# Altium project HYDRA_V3_BEACON.PrjPcb (part 2 of 2)

## Sheet SX1278_RADIO.SchDoc
size B; SheetNumber: 6; SheetTotal: 7
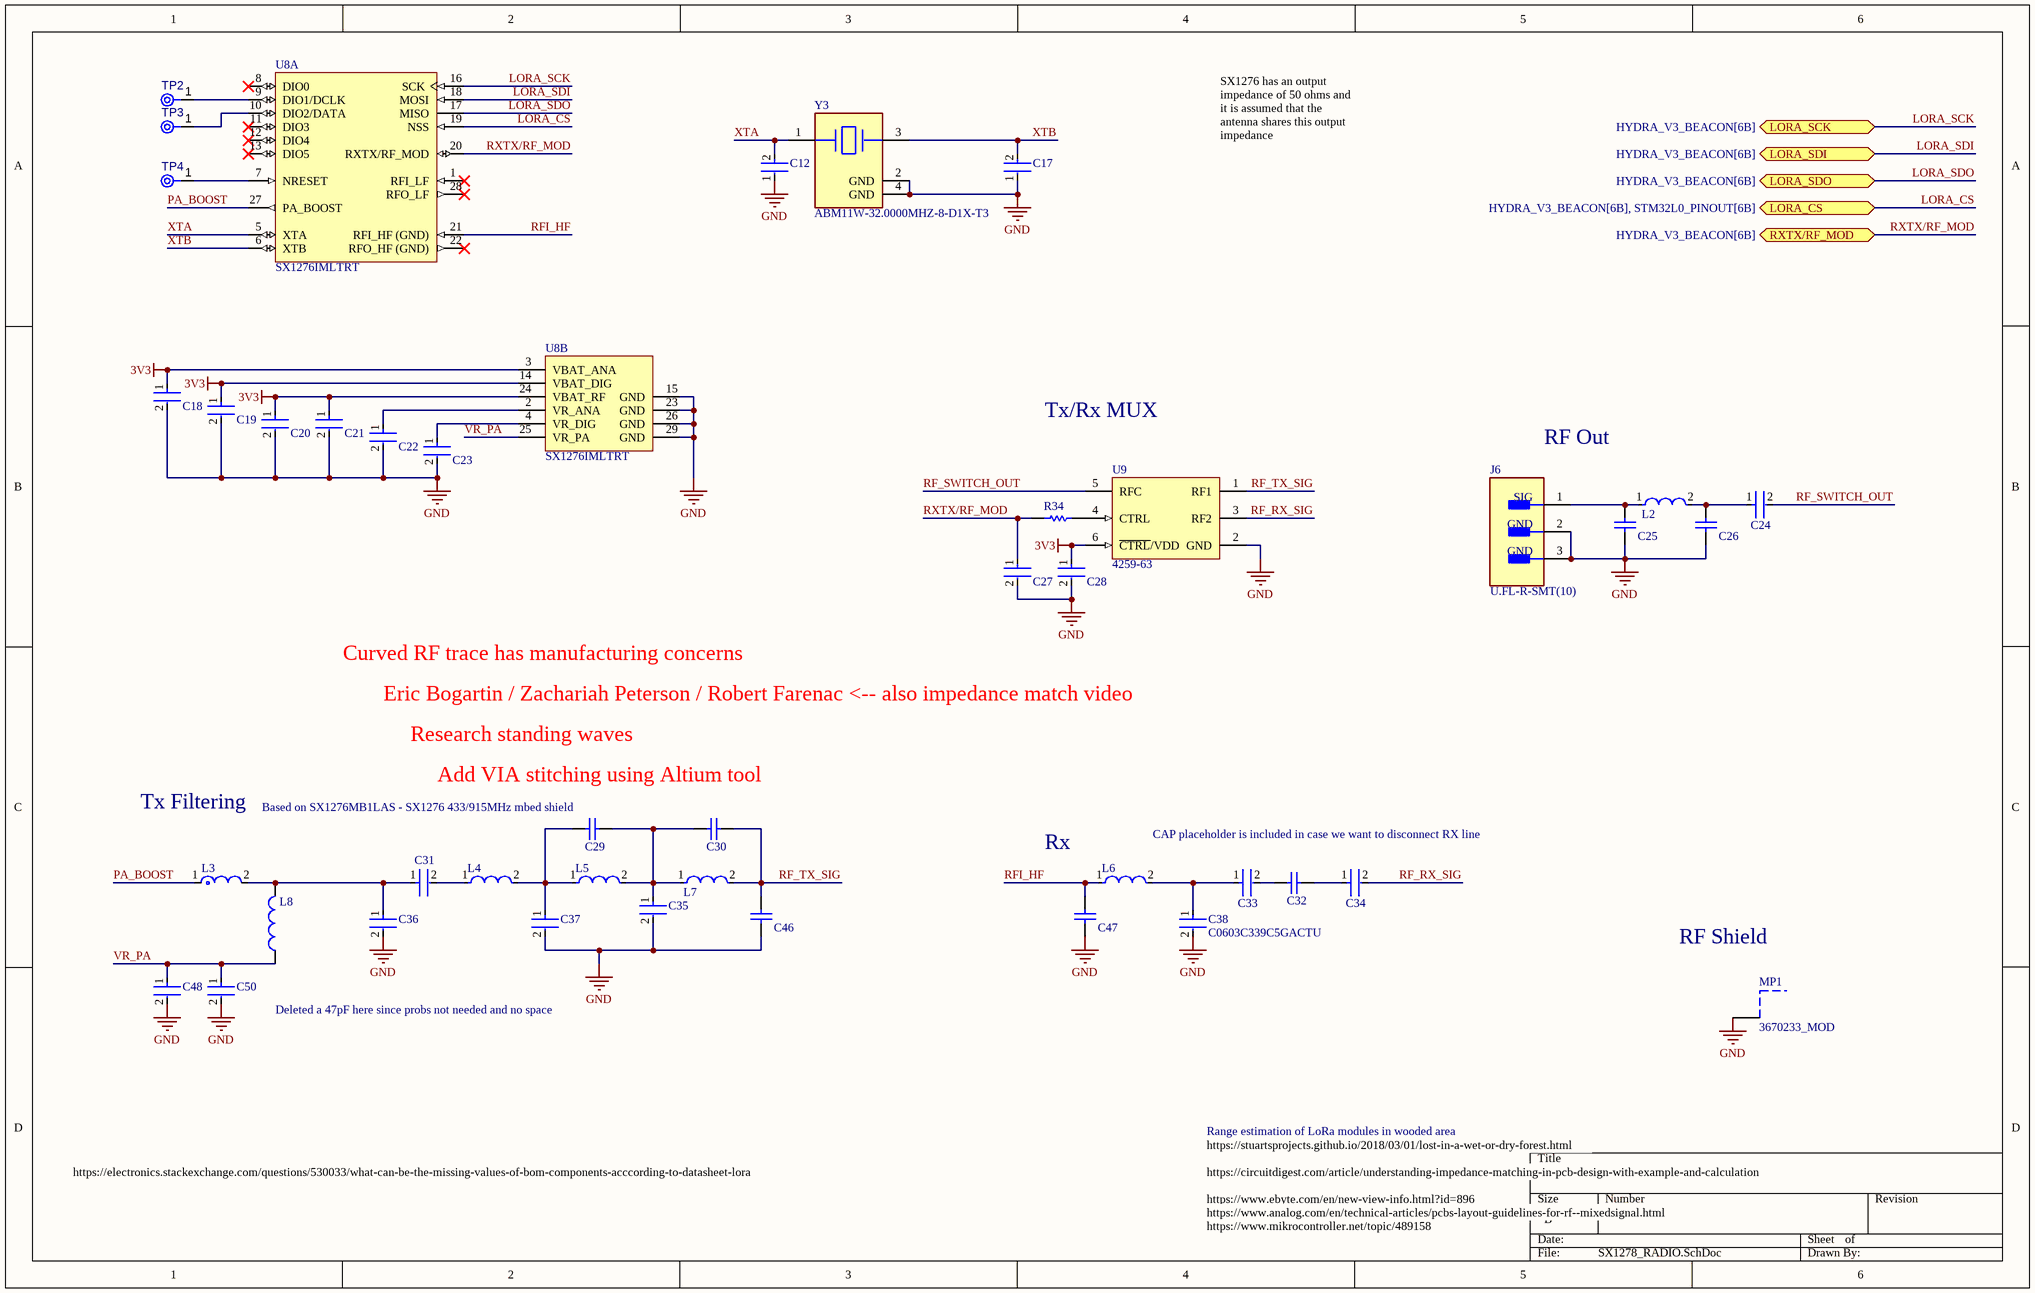
[diagram p5: SX1278_RADIO.SchDoc]

### Parts
C12  C1608C0G1H080D080AA  [FP-C1608-080-0_1-IPC_A]  (value not drawn)
C17  C1608C0G1H080D080AA  [FP-C1608-080-0_1-IPC_A]  (value not drawn)
C18  C0402C104K8PACTU  [FP-C0402-BB-MFG]  (value not drawn)
C19  C0402C104K8PACTU  [FP-C0402-BB-MFG]  (value not drawn)
C20  C0402C104K8PACTU  [FP-C0402-BB-MFG]  (value not drawn)
C21  C0402C104K8PACTU  [FP-C0402-BB-MFG]  (value not drawn)
C22  C0402C104K8PACTU  [FP-C0402-BB-MFG]  (value not drawn)
C23  C0402C104K8PACTU  [FP-C0402-BB-MFG]  (value not drawn)
C24  C0603C470J1GACTU  [FP-C0603C-CF-MFG]  (value not drawn)
C25  0603 CAP  [CAPC1608X90X40ML10T20]  (value not drawn)
C26  0603 CAP  [CAPC1608X90X40ML10T20]  (value not drawn)
C27  C0402C104K8PACTU  [FP-C0402-BB-MFG]  (value not drawn)
C28  C0402C104K8PACTU  [FP-C0402-BB-MFG]  (value not drawn)
C29  0603 CAP  [CAPC1608X90X40ML10T20]  (value not drawn)
C30  0603 CAP  [CAPC1608X90X40ML10T20]  (value not drawn)
C31  C0603C220J5GACTU  [FP-C0603C-CF-MFG]  (value not drawn)
C32  0603 CAP  [CAPC1608X90X40ML10T20]  (value not drawn)
C33  C0603C470J1GACTU  [FP-C0603C-CF-MFG]  (value not drawn)
C34  C0603C470J1GACTU  [FP-C0603C-CF-MFG]  (value not drawn)
C35  C0603C339C5GACTU  [FP-C0603C-CF-MFG]  (value not drawn)
C36  C0603C829C5GACTU  [FP-C0603C-CF-MFG]  (value not drawn)
C37  06031A6R8CAT2A  [FP-0603-L_1_6_0_15-W_0_81-IPC_C]  (value not drawn)
C38  C0603C339C5GACTU  [FP-C0603C-CF-MFG]
C46  0603 CAP  [CAPC1608X90X40ML10T20]  (value not drawn)
C47  0603 CAP  [CAPC1608X90X40ML10T20]  (value not drawn)
C48  C0603C103J3GACTU  [FP-C0603C-CF-MFG]  (value not drawn)
C50  C0603C470J1GACTU  [FP-C0603C-CF-MFG]  (value not drawn)
J6  U.FL-R-SMT(10)  [FP-U_FL-R-SMT_10-MFG]
L2  0603 IND  [FP-LQW18AN_00-MFG]  (value not drawn)
L3  LQG18HN1N5S00D  [FP-LQG18HH_00-IPC_B]  (value not drawn)
L4  LQW18AN5N6D00D  [FP-LQW18AN_00-MFG]  (value not drawn)
L5  LQW18AN5N6D00D  [FP-LQW18AN_00-MFG]  (value not drawn)
L6  LQW18AN10NG00D  [FP-LQW18AN_00-MFG]  (value not drawn)
L7  0603 IND  [FP-LQW18AN_00-MFG]  (value not drawn)
L8  B82496C3330J  [INDC1608X90X30LL10T20]  (value not drawn)
MP1  3670233_MOD  [3670233]
R34  ERJ-3EKF1001V  [RESC1608X55X30LL15T15]  (value not drawn)
TP2  TPAD6R  [TP06R]  (value not drawn)  (no BOM)
TP3  TPAD6R  [TP06R]  (value not drawn)  (no BOM)
TP4  TPAD6R  [TP06R]  (value not drawn)  (no BOM)
U8  SX1276IMLTRT  [SMTC-QFN-28_V]  (parts A,B of 2)
U9  4259-63  [PERE-SC-70-6_M]
Y3  ABM11W-32.0000MHZ-8-D1X-T3  [FP-ABM11W-MFG]

### Ports
LORA_CS (bidir, see HYDRA_V3_BEACON[6B], STM32L0_PINOUT[6B]), LORA_SCK (bidir, see HYDRA_V3_BEACON[6B]), LORA_SDI (bidir, see HYDRA_V3_BEACON[6B]), LORA_SDO (bidir, see HYDRA_V3_BEACON[6B]), RXTX/RF_MOD (bidir, see HYDRA_V3_BEACON[6B])

### Nets
3V3: C18.1 C19.1 C20.1 C21.1 C28.1 U8.3(VBAT_ANA) U8.14(VBAT_DIG) U8.24(VBAT_RF) U9.6(~{CTRL}/VDD)
GND: C12.1 C17.1 C18.2 C19.2 C20.2 C21.2 C22.2 C23.2 C25.1 C26.1 C27.2 C28.2 C35.2 C36.2 C37.2 C38.2 C46.1 C47.1 C48.2 C50.2 J6.2(GND) J6.3(GND) MP1.1 U8.15(GND) U8.23(GND) U8.26(GND) U8.29(GND) U9.2(GND) Y3.2(GND) Y3.4(GND)
LORA_CS: U8.19(NSS) ; port LORA_CS
LORA_SCK: U8.16(SCK) ; port LORA_SCK  [project net CAN_SCK]
LORA_SDI: U8.18(MOSI) ; port LORA_SDI  [project net CAN_SDI]
LORA_SDO: U8.17(MISO) ; port LORA_SDO  [project net CAN_SDO]
PA_BOOST: L3.1 U8.27(PA_BOOST)
RF_RX_SIG: C34.2 U9.3(RF2)
RF_SWITCH_OUT: C24.2 U9.5(RFC)
RF_TX_SIG: C30.2 C46.2 L7.2 U9.1(RF1)
RFI_HF: C47.2 L6.1 U8.21(RFI_HF_(GND))
RXTX/RF_MOD: C27.1 R34.2 U8.20(RXTX/RF_MOD) ; port RXTX/RF_MOD
VR_PA: C48.1 C50.1 L8.1 U8.25(VR_PA)
XTA: C12.2 U8.5(XTA) Y3.1
XTB: C17.2 U8.6(XTB) Y3.3
NetC22_1: C22.1 U8.2(VR_ANA)
NetC23_1: C23.1 U8.4(VR_DIG)
NetC24_1: C24.1 C26.2 L2.2
NetC25_2: C25.2 J6.1(SIG) L2.1
NetC29_1: C29.1 C37.1 L4.2 L5.1
NetC29_2: C29.2 C30.1 C35.1 L5.2 L7.1
NetC31_1: C31.1 C36.1 L3.2 L8.2
NetC31_2: C31.2 L4.1
NetC32_1: C32.1 C33.2
NetC32_2: C32.2 C34.1
NetC33_1: C33.1 C38.1 L6.2
NetR34_1: R34.1 U9.4(CTRL)
NetTP2_1: TP2.1(TP) U8.9(DIO1/DCLK)
NetTP3_1: TP3.1(TP) U8.10(DIO2/DATA)
NetTP4_1: TP4.1(TP) U8.7(NRESET)

Not connected (* = marked no-connect by the designer): U8 1(RFI_LF)* 8(DIO0)* 11(DIO3)* 12(DIO4)* 13(DIO5)* 22(RFO_HF_(GND))* 28(RFO_LF)*

### Notes on the sheet
- SX1276 has an output impedance of 50 ohms and it is assumed that the antenna shares this output impedance
- Tx/Rx MUX
- RF Out
- Curved RF trace has manufacturing concerns
- Eric Bogartin / Zachariah Peterson / Robert Farenac <-- also impedance match video
- Research standing waves
- Tx Filtering
- (near C29) Based on SX1276MB1LAS - SX1276 433/915MHz mbed shield
- Add VIA stitching using Altium tool
- CAP placeholder is included in case we want to disconnect RX line
- Rx
- RF Shield
- Deleted a 47pF here since probs not needed and no space
- https://electronics.stackexchange.com/questions/530033/what-can-be-the-missing-values-of-bom-components-acccording-to-datasheet-lora
- https://stuartsprojects.github.io/2018/03/01/lost-in-a-wet-or-dry-forest.html
- https://circuitdigest.com/article/understanding-impedance-matching-in-pcb-design-with-example-and-calculation
- Range estimation of LoRa modules in wooded area
- https://www.ebyte.com/en/new-view-info.html?id=896
- https://www.mikrocontroller.net/topic/489158
- https://www.analog.com/en/technical-articles/pcbs-layout-guidelines-for-rf--mixedsignal.html

### Library data of the parts
C12 C17 = CMP-08246-005081-1: Multilayer Ceramic Capacitors 8pF ±0.5pF 50V C0G SMD 0603; Insulation Resistance: 10GR; Case Code (Metric): 1608; Series: C; Construction: Flat; REACH SVHC: No SVHC; Weight: 7.1E-05oz; Length: 1.6mm; RoHS Compliant: Yes; Min Operating Temperature: -55°C; Dielectric Material: Ceramic; Dielectric: C0G; Case/Package: 0603; Width: 0.031inch; Lead Free: Lead Free; Voltage Rating (DC): 50V; Thickness: 0.037inch; Capacitance: 8pF; Radiation Hardening: No; Height: 0.8mm; Voltage Rating: 50V; Depth: 0.8mm; Package Quantity: 1; Termination: SMD/SMT; Mount: Surface Mount; Packaging: Tape and Reel; Case Code (Imperial): 0603; Max Operating Temperature: 125°C
C18-C23 C27 C28 = CMP-2008-02046-2: CAP CER 0.1UF 10V X5R 0402; Manufacturer: Kemet; Material: Ceramic; Capacitance: 0.10 μF; Temperature Coefficient: 15%; Tolerance: 0.1; Value: 0.10 μF; Package: C0402-BB; Temperature: -55°C to +125°C; ComponentLink2Description: Datasheet; Temperature Characteristic: X5R; Device Class L1: Passive Components; Height: 0.55mm; Lead Free: Yes; ComponentLink2URL: https://content.kemet.com/datasheets/KEM_C1002_X7R_SMD.pdf; Device Class L2: Capacitors; Temperature Range Low: -55°C; Temperature Range High: +125°C; RoHS: TRUE; Octopart: https://octopart.com/c0402c104k8pactu-kemet-140039; Automotive: No; Mouser Description: Capacitor 100 nF 10 VDC 0402; Category: Cap; Voltage Rating: 10 V; Digikey Description: CAP CER 0.1UF 10V X5R 0402; Ipc Land Pattern Name: CAPC10050X50; Device Class L3: Ceramic Capacitors; Manufacturer Part Number: C0402C104K8PACTU
C24 C33 C34 C50 = CMP-2006-03321-2: CAP CER 47PF 100V 5% NP0 0603; Manufacturer: KEMET; Temperature Characteristic: C0G; Temperature Coefficient: 30ppm/°C; Automotive Grade: Grade 1; Material: Ceramic; Tolerance: 0.05; Digikey Description: CAP CER 47PF 100V 5% NP0 0603; Value: 47 pF; Category: Cap; Device Class L2: Capacitors; Device Class L1: Passive Components; Package: C0603C-CF; Octopart: https://octopart.com/c0603c470j1gactu-kemet-3768219; Lead Free: Yes; Temperature Range High: +125°C; Device Class L3: Ceramic Capacitors; Height: 0.87mm; Temperature: -55°C to +125°C; Mouser Description: Multilayer Ceramic Capacitors MLCC - SMD/SMT 100volts 47pF C0G 5%; Automotive: Yes; Capacitance: 47 pF; RoHS: TRUE; ComponentLink2URL: https://api.kemet.com/component-edge/download/datasheet/C0603C100J5GACAUTO.pdf; Voltage Rating: 100 V; Manufacturer Part Number: C0603C470J1GACTU; ComponentLink2Description: Datasheet; Temperature Range Low: -55°C
C25 C26 C29 C30 C32 C46 C47 = CMP-001-00087-1: 0pF 0603 capacitor placeholder
C31 = CMP-2006-03119-3: Cap Ceramic 22pF 50V C0G 5% SMD 0603 125°C Paper T/R; Manufacturer: KEMET; Temperature Coefficient: 30ppm/°C; Automotive Grade: Grade 1; Tolerance: 0.05; RoHS: TRUE; Temperature Characteristic: C0G; Capacitance: 22 pF; Device Class L3: Ceramic Capacitors; Digikey Description: Cap Ceramic 22pF 50V C0G 5% SMD 0603 125°C Paper T/R; ComponentLink2URL: https://api.kemet.com/component-edge/download/datasheet/C0603C100J5GACAUTO.pdf; ComponentLink2Description: Datasheet; Automotive: Yes; Temperature: -55°C to +125°C; Temperature Range High: +125°C; Package: C0603C-CF; Device Class L1: Passive Components; Device Class L2: Capacitors; Lead Free: Yes; Value: 22 pF; Manufacturer Part Number: C0603C220J5GACTU; Category: Cap; Mouser Description: Cap Ceramic 22pF 50V C0G 5% SMD 0603 125°C Paper T/R; Voltage Rating: 50 V; Height: 0.87mm; Material: Ceramic; Temperature Range Low: -55°C; Octopart: https://octopart.com/c0603c220j5gactu-kemet-98525
C35 C38 = CMP-1035-00238-3: CAP CER 3.3PF 50V NP0 0603; Manufacturer: KEMET; Tolerance: 0.25 pF; Material: Ceramic; Temperature Characteristic: C0G; Automotive Grade: Grade 1; Temperature Coefficient: 30ppm/°C; Height: 0.87mm; Category: Cap; Automotive: Yes; Voltage Rating: 50 V; Capacitance: 3.3 pF; ComponentLink2Description: Datasheet; Octopart: https://octopart.com/c0603c339c5gactu-kemet-3701205; Temperature Range Low: -55°C; Device Class L3: Ceramic Capacitors; Manufacturer Part Number: C0603C339C5GACTU; Package: C0603C-CF; Temperature: -55°C to +125°C; Digikey Description: CAP CER 3.3PF 50V NP0 0603; Temperature Range High: +125°C; ComponentLink2URL: https://api.kemet.com/component-edge/download/datasheet/C0603C100J5GACAUTO.pdf; Device Class L1: Passive Components; Value: 3.3 pF; RoHS: TRUE; Lead Free: Yes; Mouser Description: Multilayer Ceramic Capacitors MLCC - SMD/SMT 50volts 3.3pF C0G 0.25%; Device Class L2: Capacitors
C36 = CMP-2006-03332-2: CAP CER 8.2PF 50V NP0 0603; Manufacturer: KEMET; Temperature Coefficient: 30ppm/°C; Temperature Characteristic: C0G; Material: Ceramic; Tolerance: 0.25 pF; Automotive Grade: Grade 1; Octopart: https://octopart.com/c0603c829c5gactu-kemet-8375751; Automotive: Yes; RoHS: TRUE; Manufacturer Part Number: C0603C829C5GACTU; Temperature Range High: +125°C; Category: Cap; Digikey Description: CAP CER 8.2PF 50V NP0 0603; Value: 8.2 pF; Temperature: -55°C to +125°C; Package: C0603C-CF; Device Class L1: Passive Components; Device Class L3: Ceramic Capacitors; Device Class L2: Capacitors; ComponentLink2Description: Datasheet; Height: 0.87mm; Capacitance: 8.2 pF; Lead Free: Yes; Voltage Rating: 50 V; Mouser Description: Multilayer Ceramic Capacitors MLCC - SMD/SMT 50volts 8.2pF C0G 0.25%; ComponentLink2URL: https://api.kemet.com/component-edge/download/datasheet/C0603C100J5GACAUTO.pdf; Temperature Range Low: -55°C
C37 = CMP-1035-00440-3: General Purpose Ceramic Capacitor, 0603, 6.8pF, 0.25pF, NP0, 30ppm/°C, 100V; Dielectric: C0G; Voltage Rating: 100V; Package Quantity: 1; Height: 0.86mm; Number of Pins: 2; Depth: 0.81mm; Voltage: 100V; Case Code (Imperial): 0603; Series: -; Case/Package: 0603; Capacitance: 6.8pF; Termination: SMD/SMT; Case Code (Metric): 1608; Lead Free: Lead Free; Voltage Rating (DC): 100V; Mount: Surface Mount; Dielectric Material: Ceramic; Packaging: Tape and Reel; Min Operating Temperature: -55°C; Construction: Flat; Width: 0.032inch; Thickness: 0.035inch; RoHS Compliant: Yes; Radiation Hardening: No; Max Operating Temperature: 125°C; Length: 1.6mm
C48 = CMP-2006-03705-3: CAP CER 10000PF 25V 5% NP0 0603; Manufacturer: KEMET; Material: Ceramic; Temperature Coefficient: 30ppm/°C; Automotive Grade: Grade 1; Capacitance: 10,000 pF; Temperature Characteristic: C0G; Value: 10,000 pF; Tolerance: 0.05; Temperature: -55°C to +125°C; ComponentLink2URL: https://api.kemet.com/component-edge/download/datasheet/C0603C100J5GACAUTO.pdf; ComponentLink2Description: Datasheet; Digikey Description: CAP CER 10000PF 25V 5% NP0 0603; Octopart: https://octopart.com/c0603c103j3gactu-kemet-10686801; Package: C0603C-CF; Automotive: Yes; Category: Cap; Manufacturer Part Number: C0603C103J3GACTU; Voltage Rating: 25 V; RoHS: TRUE; Device Class L1: Passive Components; Temperature Range Low: -55°C; Lead Free: Yes; Height: 0.87mm; Temperature Range High: +125°C; Device Class L3: Ceramic Capacitors; Mouser Description: 0603 C 10nF Ceramic Multilayer Capacitor, 25 V, +125degC, C0G Dielectric, +/-5%; Device Class L2: Capacitors
J6 = CMP-0029-00003-2: CONN U.FL RCPT STR 50 OHM SMD; Plating: Silver; Connector Type: Coaxial; Frequency: 6GHz; Impedance: 50R; Body Material: Bronze; Dielectric Material: Polymer; Contact Plating: Gold; Termination: Solder; Orientation: Vertical; Contact Material: Brass; Min Operating Temperature: -40°C; Mount: Surface Mount; Lead Free: Lead Free; Max Operating Temperature: 90°C; Radiation Hardening: No; Packaging: Tape and Reel; Body Plating: Silver; Fastening Type: Snap; Max Frequency: 6GHz; Depth: 3.1mm; Package Quantity: 1; Case/Package: SMD/SMT; Housing Color: Beige; Length: 3mm
L2 L7 = CMP-006-00021-1: 0uH 0603 inductor placeholder
L3 = CMP-06042-002746-1: Multilayer type RF Inductor 1.5nH ±0.3nH 0.1Ω 1100mA 0603; DC Current: 500mA; DC Resistance (DCR): 100mR; Shielding: Unshielded; Core Material: Air; Self Resonant Frequency: 6GHz; Q Factor: 12; Test Frequency: 100MHz; Max Operating Temperature: 85°C; Length: 1.6mm; Radiation Hardening: No; Inductance: 1.5nH; Max DC Current: 500mA; Case/Package: 0603; Width: 0.8mm; Height: 0.8mm; Number of Pins: 2; Depth: 0.95mm; Mount: Surface Mount; Packaging: Tape and Reel; Height - Seated (Max): 0.037inch; Case Code (Metric): 1608; Package Quantity: 4000; Current Rating: 500mA; Lead Free: Lead Free; Military Standard: Not; Case Code (Imperial): 0603; Min Operating Temperature: -55°C; Termination: SMD/SMT; REACH SVHC: No SVHC
L4 L5 = CMP-06042-003914-1: Wire Wound RF Inductor 5.6nH ±0.5nH 750mA 0.082Ω 0603 (1608); Test Frequency: 100MHz; Self Resonant Frequency: 6GHz; Q Factor: 35; Core Material: Non-Magnetic; DC Resistance (DCR): 82mR; Shielding: Unshielded; Number of Pins: 2; Case Code (Imperial): 0603; Height: 0.8mm; Packaging: Tape and Reel; Case/Package: 0603; Lead Free: Lead Free; Height - Seated (Max): 0.039inch; Width: 0.8mm; Military Standard: Not; Weight: 0.000106oz; Length: 1.6mm; Case Code (Metric): 1608; Radiation Hardening: No; DC Current: 750mA; Resistor Type: Wirewound; Min Operating Temperature: -55°C; Max DC Current: 750mA; Package Quantity: 4000; Current Rating: 750mA; Termination: SMD/SMT; Depth: 1mm; Max Operating Temperature: 125°C; REACH SVHC: No SVHC; Mount: Surface Mount; Inductance: 5.6nH
L6 = CMP-2000-06599-2: Wire Wound RF Inductor 10nH ±2% 650mA 0.11Ω 0603 (1608); DC Resistance (DCR): 110mR; Q Factor: 35; Shielding: Unshielded; Test Frequency: 100MHz; Current: 550mA; Self Resonant Frequency: 6GHz; Radiation Hardening: No; Depth: 1mm; Case Code (Imperial): 0603; Inductance: 10nH; Inductance Tolerance: 2%; Series: LQW18A_00; Tolerance: 2%; Weight: 0.000106oz; Rated Current-Max: 650mA; Mount: Surface Mount; Series Resistance: 110mR; REACH SVHC: No SVHC; Current Rating: 650mA; Case Code (Metric): 1608; Lead Free: Lead Free; Resistor Type: Wirewound; Package Quantity: 4000; Termination: SMD/SMT; DC Current: 650mA; Height: 0.8mm; Min Operating Temperature: -55°C; Military Standard: Not; Max Operating Temperature: 125°C; Max DC Current: 650mA; Case/Package: 0603; Number of Pins: 2; Packaging: Tape and Reel; Width: 0.8mm; Length: 1.6mm
L8 = CMP-2000-05913-1: Unshielded Wirewound Inductor, 33 nH, 350 mA, -55 to 150 degC, 0603 (1608 Metric), RoHS, Tape and Reel; Manufacturer: EPCOS-(TDK); Q @ Freq: 14@100MHz; Inductance: 33nH; Material - Core: Ceramic; Frequency - Self Resonant: 3GHz; DC Resistance (DCR): 600mOhmMax; Tolerance: ±5%; Frequency - Test: 100MHz; Current Rating: 350mA; Manufacturer URL: http://www.tdk.com/; Type: Wirewound; Mounting Type: SurfaceMount; Mounting Technology: SurfaceMount; Height - Seated (Max): 0.035"(0.90mm); Datasheet URL: https://en.tdk.eu/inf/30/db/ind_2008/b82496c.pdf; Shielding: Unshielded; Operating Temperature: -; Size / Dimension: 0.063"Lx0.031"W(1.60mmx0.80mm); Series: SIMID; Current - Saturation: -; Ratings: AEC-Q200; Packaging: CutTape(CT); Package Reference: 0603; Datasheet Version: 07/2016; Category: Inductors,Coils,Chokes; Package Description: 2-Pin Surface Mount Device, Body 1.6 x 0.8 mm; Family: FixedInductors; Package / Case: 0603(1608Metric)
MP1 = CMP-00025-00007-1: WE-SHC Two-piece Seamless Shielding Cabinet - MODIFIED FOOTPRINT TO ALLOW RF SIGNAL TRACE THROUGH BOTTOM RIGHT
R34 = CMP-2000-00180-1: Manufacturer: Panasonic; Part Number: ERJ-3EKF1001V
TP2-TP4 = CMP-00028-00002-2: 0.6mm round; Pins: 1
U8 = CMP-2000-05356-1: Low Power Long Range Transceiver, 137 to 1020 MHz, -40 to 85 degC, 28-Pin QFN, RoHS, Tape and Reel; Manufacturer: Semtech; Power - Output: 20dBm; Data Rate (Max): 300kbps; Sensitivity: -148dBm; Featured Product: SX1276LongRangeTransceiver; PCN Design/Specification: CopperWire25/Mar/2014; GPIO: 6; Frequency: 137MHz~1.02GHz; Voltage - Supply: 1.8V~3.7V; Protocol: LoRa™; Current - Transmitting: 20mA~120mA; Current - Receiving: 10.8mA~12mA; Online Catalog: SX1276,SX1277andSX1278; Design Resources: SX127xReferenceDesignOverviewDevelopmentToolSelector; Serial Interfaces: SPI; Mfg Application Notes: LoRaModulation:CrystalOscillatorGuidanceSX12xxSoftwareImplementationofDataWhiteningandCRCSX127xLoRaLowEnergyDesignGuideSX127xLoRaModemDesignersGuide; Modulation: FSK,GFSK,GMSK,MSK,OOK; Other Names: SX1276IMLTRTTR; Series: -; Manufacturer URL: http://www.semtech.com/; Datasheet URL: http://www.semtech.com/images/datasheet/sx1276.pdf; Type: TxRx+MCU; RF Family/Standard: 802.15.4; Package Reference: QFN-28; Standard Package: 3,000; Package Description: 28-Pin Quad Flat No-lead Package, Body 6 x 6 mm, Pitch 0.65 mm; Category: RF/IFandRFID; Operating Temperature: -40degC~85degC; Datasheet Version: Rev. 4, 03/2015; Memory Size: -; Family: RFTransceiverICs; Packaging: Tape&Reel(TR); Package / Case: 28-VQFNExposedPad
U9 = CMP-2000-05298-1: IC RF Switch SPDT, 50 Ohm, 6-Pin SC70, RoHS, Tape and Reel; Manufacturer: Peregrine Semiconductor; P1dB: 29dBm(typ)IP1dB; Topology: Reflective; Frequency - Upper: 3GHz; Insertion Loss @ Frequency: 0.5dB@2GHz; IIP3: 55dBm(typ); Voltage - Supply: 1.8V~3.3V; Other Names: 1046-1011-24259-63-ND425963PE4259PE4259SCBC-ZPE4259SCBC-Z-ND; Isolation @ Frequency: 20dB@2GHz(typ); Frequency - Lower: 10MHz; Online Catalog: PE4259; Impedance: 50Ohm; RF Type: GeneralPurpose; Series: UltraCMOS; Manufacturer URL: http://www.psemi.com/; Package Description: 6-Pin Small Outline Transistor, Body 2.05 x 1.25 mm, Pitch 0.65 mm; Family: RFSwitches; Packaging: Tape&Reel(TR); Features: Single/DualLineControl; Package / Case: 6-TSSOP,SC-88,SOT-363; Operating Temperature: -40degC~85degC; Circuit: SPDT; Supplier Device Package: SC-70-6; Standard Package: 3,000; Datasheet URL: https://datasheet.ciiva.com/15100/getdatasheetpartid-685660-15100501.pdf; Category: RF/IFandRFID; Datasheet Version: Jan-11; Package Reference: SC-70-6
Y3 = CMP-27762-001566-1: Crystal 32MHz ±10ppm 8pF SMD-4 2mm x 1.6mm; ESR (Equivalent Series Resistance): 80R; Frequency Stability: 20ppm; Mount: Surface Mount; Packaging: Cut Tape; Case/Package: SMD/SMT; Min Operating Temperature: -40°C; Frequency: 32MHz; RoHS Compliant: Yes; Load Capacitance: 8pF; Max Operating Temperature: 85°C; Frequency Tolerance: 10ppm

## Sheet PWR_MGMT.SchDoc
size B; SheetNumber: 7; SheetTotal: 7
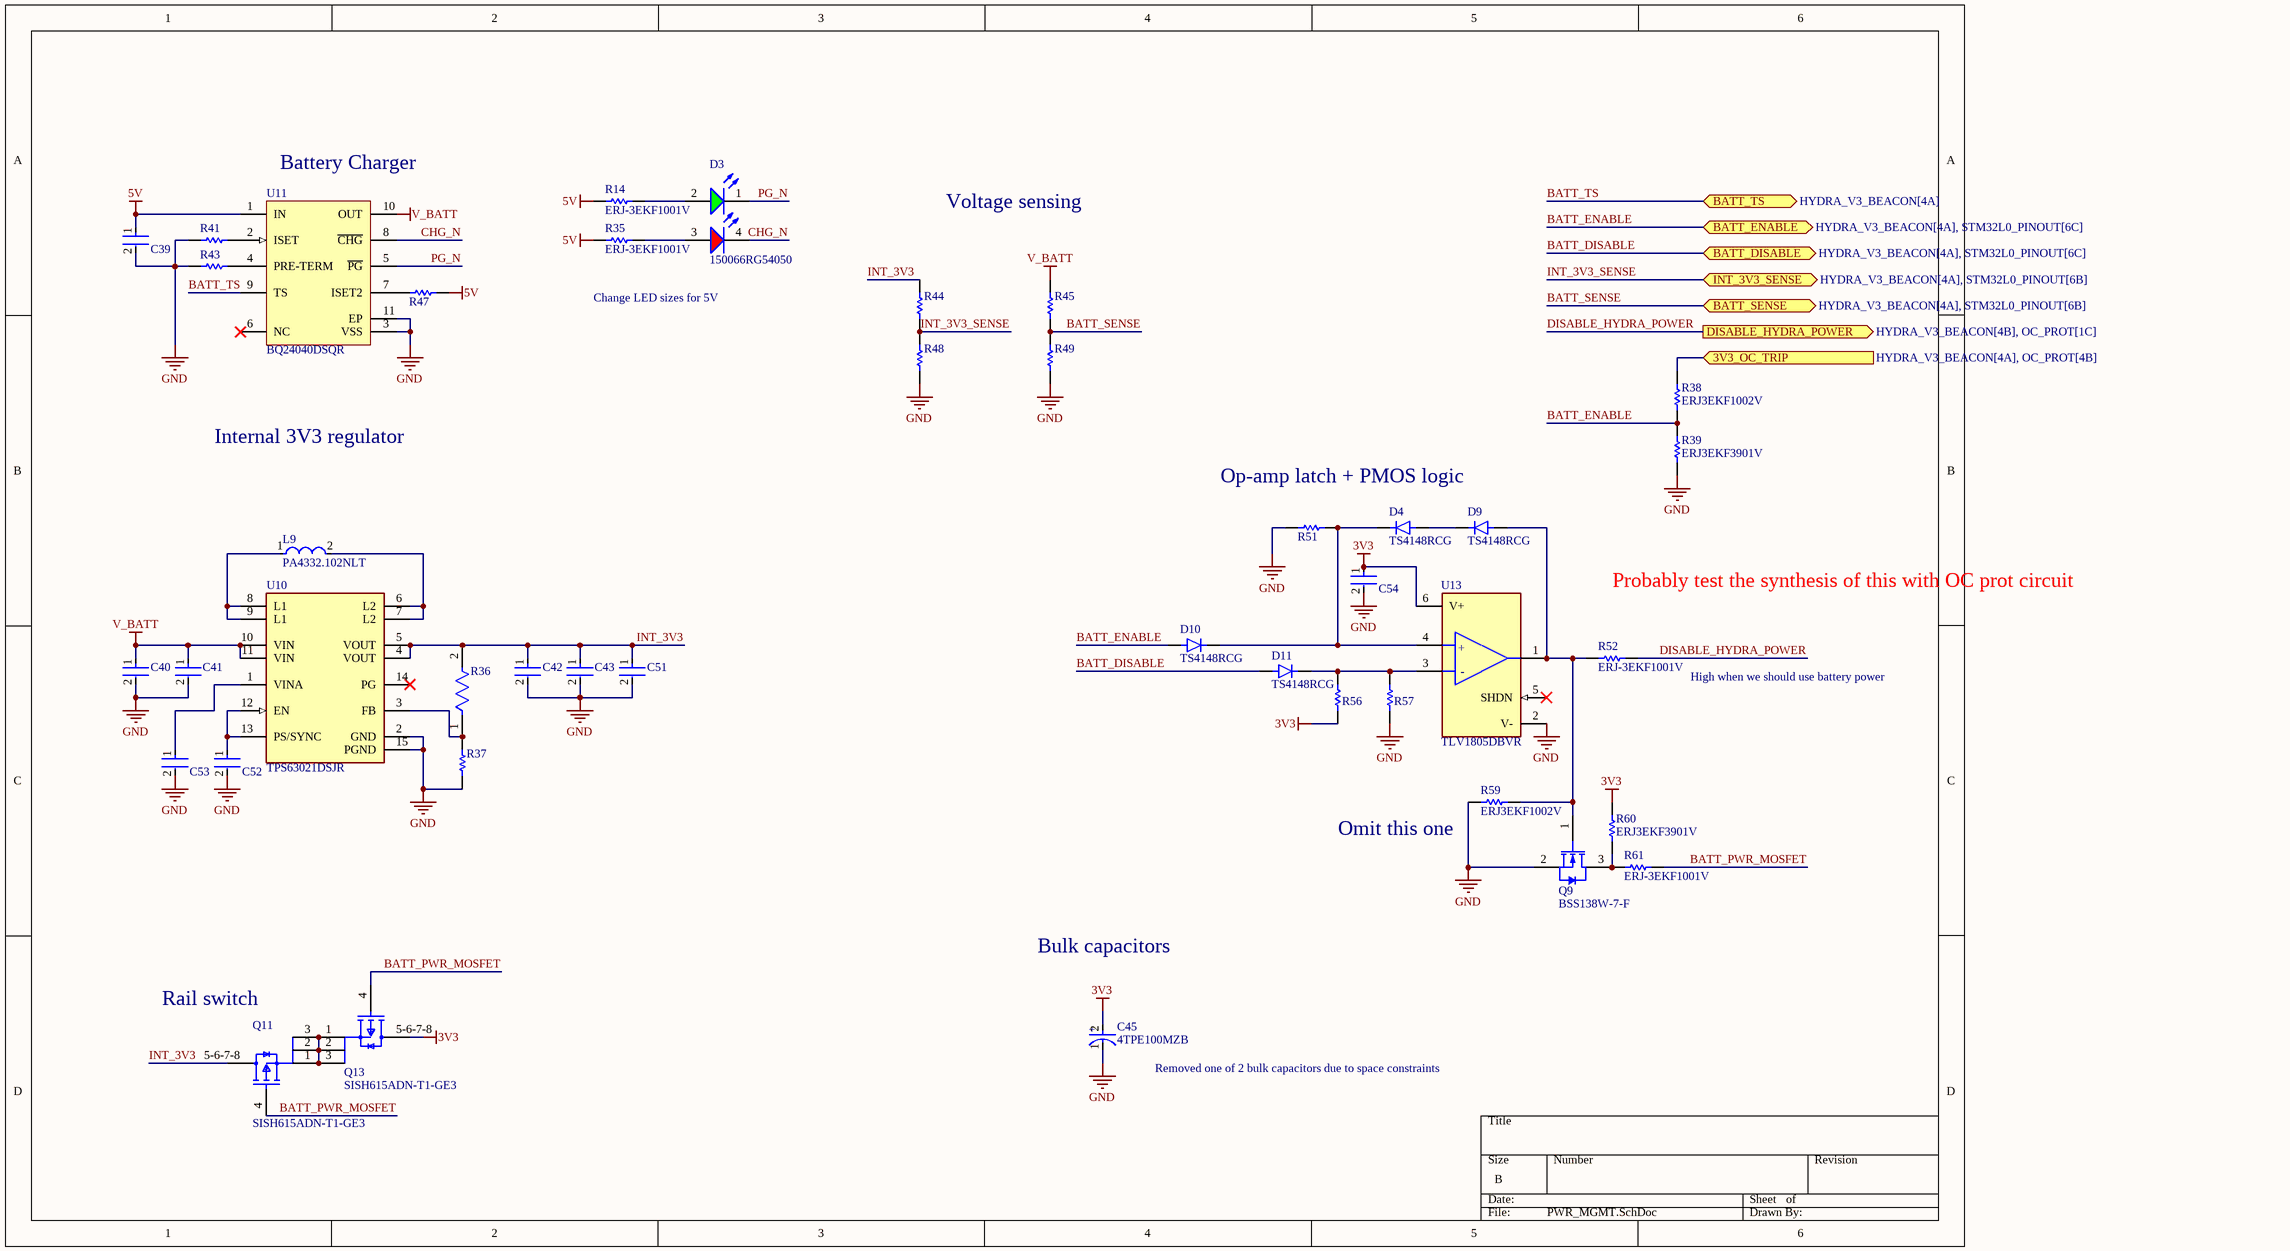
[diagram p6: PWR_MGMT.SchDoc]

### Parts
C39  C0402C104K8PACTU  [FP-C0402-BB-MFG]  (value not drawn)
C40  C0805C106K8PACTU  [FP-C0805C-DG-MFG]  (value not drawn)
C41  C0805C106K8PACTU  [FP-C0805C-DG-MFG]  (value not drawn)
C42  GRM21BR60J226ME39L  [FP-GRM21B-0_15-MFG]  (value not drawn)
C43  GRM21BR60J226ME39L  [FP-GRM21B-0_15-MFG]  (value not drawn)
C45  4TPE100MZB  [FP-POSCAP-B2-MFG]
C51  GRM21BR60J226ME39L  [FP-GRM21B-0_15-MFG]  (value not drawn)
C52  C0402C104K8PACTU  [FP-C0402-BB-MFG]  (value not drawn)
C53  C0402C104K8PACTU  [FP-C0402-BB-MFG]  (value not drawn)
C54  C0402C104K8PACTU  [FP-C0402-BB-MFG]  (value not drawn)
D3  150066RG54050  [WL-SBCD_0606]
D4  TS4148RCG  [TS4148RCG-Footprint-1]
D9  TS4148RCG  [TS4148RCG-Footprint-1]
D10  TS4148RCG  [TS4148RCG-Footprint-1]
D11  TS4148RCG  [TS4148RCG-Footprint-1]
L9  PA4332.102NLT  [FP-PA4332-MFG]
Q9  BSS138W-7-F  [DIOD-SOT323-3_V]
Q11  SISH615ADN-T1-GE3  [SISH615ADN-T1-GE3-Footprint-1]
Q13  SISH615ADN-T1-GE3  [SISH615ADN-T1-GE3-Footprint-1]
R14  ERJ-3EKF1001V  [RESC1608X55X30LL15T15]
R35  ERJ-3EKF1001V  [RESC1608X55X30LL15T15]
R36  ERJ-3EKF1004V  [FP-ERJ3EK-IPC_C]  (value not drawn)
R37  ERJ3EKF1803V  [RESC1608X55X30LL15T15]  (value not drawn)
R38  ERJ3EKF1002V  [RESC1609X55X30LL15T15]
R39  ERJ3EKF3901V  [RESC1608X55X30ML15T15]
R41  ERJ-3EKF1001V  [RESC1608X55X30LL15T15]  (value not drawn)
R43  ERJ-3EKF1001V  [RESC1608X55X30LL15T15]  (value not drawn)
R44  ERJ3EKF1002V  [RESC1609X55X30LL15T15]  (value not drawn)
R45  ERJ3EKF1002V  [RESC1609X55X30LL15T15]  (value not drawn)
R47  ERJ3EKF1002V  [RESC1609X55X30LL15T15]  (value not drawn)
R48  ERJ3EKF1002V  [RESC1609X55X30LL15T15]  (value not drawn)
R49  ERJ3EKF1002V  [RESC1609X55X30LL15T15]  (value not drawn)
R51  ERJ3EKF1002V  [RESC1609X55X30LL15T15]  (value not drawn)
R52  ERJ-3EKF1001V  [RESC1608X55X30LL15T15]
R56  ERJ3EKF1002V  [RESC1609X55X30LL15T15]  (value not drawn)
R57  ERJ3EKF1002V  [RESC1609X55X30LL15T15]  (value not drawn)
R59  ERJ3EKF1002V  [RESC1609X55X30LL15T15]
R60  ERJ3EKF3901V  [RESC1608X55X30ML15T15]
R61  ERJ-3EKF1001V  [RESC1608X55X30LL15T15]
U10  TPS63021DSJR  [FP-DSJ0014A-MFG]
U11  BQ24040DSQR  [DSQ0010A_V]
U13  TLV1805DBVR  [FP-DBV0006A-IPC_C]

### Ports
3V3_OC_TRIP (in, see HYDRA_V3_BEACON[4A], OC_PROT[4B]), BATT_DISABLE (bidir, see HYDRA_V3_BEACON[4A], STM32L0_PINOUT[6C]), BATT_ENABLE (bidir, see HYDRA_V3_BEACON[4A], STM32L0_PINOUT[6C]), BATT_SENSE (bidir, see HYDRA_V3_BEACON[4A], STM32L0_PINOUT[6B]), BATT_TS (bidir, see HYDRA_V3_BEACON[4A]), DISABLE_HYDRA_POWER (out, see HYDRA_V3_BEACON[4B], OC_PROT[1C]), INT_3V3_SENSE (bidir, see HYDRA_V3_BEACON[4A], STM32L0_PINOUT[6B])

### Nets
3V3: C45.2(A) C54.1 Q13.5-6-7-8(D) R56.1 R60.2 U13.6(V+)
5V: C39.1 R14.1 R35.1 R47.2 U11.1(IN)
GND: C39.2 C40.2 C41.2 C42.2 C43.2 C45.1(C) C51.2 C52.2 C53.2 C54.2 Q9.2(S) R37.1 R39.1 R41.2 R43.2 R48.1 R49.1 R51.2 R57.1 R59.2 U10.2(GND) U10.15(PGND) U11.3(VSS) U11.11(EP) U13.2(V-)
V_BATT: C40.1 C41.1 R45.2 U10.10(VIN) U10.11(VIN) U11.10(OUT)
3V3_OC_TP: R38.2 ; port 3V3_OC_TRIP
BATT_DISABLE: D11.A ; port BATT_DISABLE
BATT_ENABLE: D10.A R38.1 R39.2 ; port BATT_ENABLE
BATT_PWR_MOSFET: Q11.4(G) Q13.4(G) R61.2
BATT_SENSE: R45.1 R49.2 ; port BATT_SENSE
BATT_TS: U11.9(TS) ; port BATT_TS
CHG_N: D3.4(K) U11.8(~{CHG})
DISABLE_HYDRA_POWER: R52.1 ; port DISABLE_HYDRA_POWER
INT_3V3: C42.1 C43.1 C51.1 Q11.5-6-7-8(D) R36.2 R44.2 U10.4(VOUT) U10.5(VOUT)
INT_3V3_SENSE: R44.1 R48.2 ; port INT_3V3_SENSE
PG_N: D3.1(K) U11.5(~{PG})
NetC52_1: C52.1 U10.12(EN) U10.13(PS/SYNC)
NetC53_1: C53.1 U10.1(VINA)
NetD3_2: D3.2(A) R14.2
NetD3_3: D3.3(A) R35.2
NetD4_A: D4.A D9.C(K)
NetD4_C: D4.C(K) D10.C(K) R51.1 U13.4(+IN)
NetD9_A: D9.A Q9.1(G) R52.2 R59.1 U13.1(OUT)
NetD11_C: D11.C(K) R56.2 R57.2 U13.3(-IN)
NetL9_1: L9.1 U10.8(L1) U10.9(L1)
NetL9_2: L9.2 U10.6(L2) U10.7(L2)
NetQ9_3: Q9.3(D) R60.1 R61.1
NetQ11_1: Q11.1(S) Q11.2(S) Q11.3(S) Q13.1(S) Q13.2(S) Q13.3(S)
NetR36_1: R36.1 R37.2 U10.3(FB)
NetR41_1: R41.1 U11.2(ISET)
NetR43_1: R43.1 U11.4(PRE-TERM)
NetR47_1: R47.1 U11.7(ISET2)

Not connected (* = marked no-connect by the designer): U10 14(PG)*; U11 6(NC)*; U13 5(SHDN)*

### Notes on the sheet
- (near U11) Battery Charger
- Voltage sensing
- Change LED sizes for 5V
- Internal 3V3 regulator
- Op-amp latch + PMOS logic
- Probably test the synthesis of this with OC prot circuit
- High when we should use battery power
- (near R59) Omit this one
- (near Q11) Rail switch
- Bulk capacitors
- Removed one of 2 bulk capacitors due to space constraints
- (in symbol CMP-04896-000098-1) +; -
- (in symbol CMP-05428-001141-1) +

### Library data of the parts
C39 C52-C54 = CMP-2008-02046-2: as C18 on sheet SX1278_RADIO; Package: C0402-BB; Temperature: -55°C to +125°C; ComponentLink2Description: Datasheet; Temperature Characteristic: X5R; Device Class L1: Passive Components; Height: 0.55mm; Lead Free: Yes; ComponentLink2URL: https://content.kemet.com/datasheets/KEM_C1002_X7R_SMD.pdf; Device Class L2: Capacitors; Temperature Range Low: -55°C; Temperature Range High: +125°C; RoHS: TRUE; Octopart: https://octopart.com/c0402c104k8pactu-kemet-140039; Automotive: No; Mouser Description: Capacitor 100 nF 10 VDC 0402; Category: Cap; Voltage Rating: 10 V; Digikey Description: CAP CER 0.1UF 10V X5R 0402; Ipc Land Pattern Name: CAPC10050X50; Device Class L3: Ceramic Capacitors; Manufacturer Part Number: C0402C104K8PACTU
C40 C41 = CMP-2007-03243-2: CAP CER 10UF 10V X5R 0805; Manufacturer: Kemet; 3DS Part Number: 220-00001; Tolerance: 10%; Temperature Coefficient: 15%; Material: Ceramic; Device Class L2: Capacitors; Device Class L1: Passive Components; ComponentLink2URL: https://content.kemet.com/datasheets/KEM_C1006_X5R_SMD.pdf; Height: 1.4mm; Lead Free: Yes; Manufacturer Part Number: C0805C106K8PACTU; Digikey Description: CAP CER 10UF 10V X5R 0805; Octopart: https://octopart.com/c0805c106k8pactu-kemet-98697; Capacitance: 10uF; Value: 10uF; Temperature Range Low: -55°C; Temperature: -55°C to +85°C; Automotive: No; Mouser Description: CAP CER 10UF 10V X5R 0805; Ipc Land Pattern Name: CAPC200125X125; Temperature Range High: +85°C; Voltage: 10V; RoHS: TRUE; Device Class L3: Ceramic Capacitors; ComponentLink2Description: Datasheet; Voltage Rating: 10V; Package: C0805C-DG; Temperature Characteristic: X5R; Category: Cap
C42 C43 C51 = CMP-2007-03385-2: Chip Multilayer Ceramic Capacitors for General Purpose, 0805, 22uF, X5R, 15%, 20%, 6.3V; Material: Ceramic; Max Operating Temperature: 85°C; Voltage: 6.3V; Min Operating Temperature: -55°C; Case/Package: 0805; Thickness: 0.053inch; Dielectric: X5R; Packaging: Tape and Reel; Depth: 1.25mm; Termination: SMD/SMT; Voltage Rating (DC): 6.3V; Radiation Hardening: No; Tolerance: 20%; Mount: Surface Mount; Lead Free: Lead Free; Package Quantity: 1; REACH SVHC: No SVHC; Voltage Rating: 6.3V; Capacitance: 22uF; Length: 2mm; Case Code (Imperial): 0805; Case Code (Metric): 2012; Width: 0.049inch; Height: 1.25mm
C45 = CMP-05428-001141-1: Molded Tantalum Polymer Capacitor 100uF 20% 4V life 1000Hours SMD 1411; Leakage Current: 40uA; Polarity: Polar; Dissipation Factor: 8%; ESR (Equivalent Series Resistance): 35mR; Ripple Current: 1.4A; Capacitance: 100uF; Voltage: 4V; Voltage Rating (DC): 4V; Package Quantity: 2000; Packaging: Tape and Reel; RoHS Compliant: Yes; Voltage Rating: 4V; Case Code (Imperial): 1210; Construction: Flat; Max Operating Temperature: 105°C; Termination: SMD/SMT; Case Code (Metric): 3528; Case/Package: Molded; Tolerance: 20%; Min Operating Temperature: -55°C; Lead Free: Lead Free; Features: General Purpose; Height: 1.9mm; Length: 3.5mm; Series: POSCAP™ TPE; Number of Pins: 2; Height - Seated (Max): 0.079inch; Mount: Surface Mount; Width: 2.8mm; REACH SVHC: No SVHC; Radiation Hardening: No; Depth: 2.8mm
D3 = CMP-004-00034-2: Led, Red/Grn, 180Mcd/230Mcd, 624Nm/525Nm Rohs Compliant: Yes
D4 D9-D11 = CMP-004-00036-1: SMD Si-Diode 75V 100mA 0603
L9 = CMP-16293-000006-1: FIXED IND 1UH 5.8A 26 MOHM SMD; DC Resistance (DCR): 26mR; Self Resonant Frequency: 37MHz; Tolerance: 20%; Saturation Current: 8.5A; Core Material: Ferrite; Shielding: Shielded; Test Frequency: 1MHz; Min Operating Temperature: -40°C; Composition: Wirewound; Max Operating Temperature: 125°C; Packaging: Tape and Reel; Mount: Surface Mount; Length: 0.165inch; Current Rating: 5.8A; Inductance: 1uH; Case/Package: Nonstandard; Height - Seated (Max): 0.079inch; Width: 0.165inch
Q9 = CMP-2000-05968-1: N-Channel Enhancement Mode Mosfet, 50 V, 200 mA, -55 to 150 degC, 6-Pin SOT-323, RoHS, Tape and Reel; Typical Turn-Off Delay Time: 20ns; Number of Channels: 1Channel; Type: EnhancementModeFieldEffectTransistor; Brand: DiodesIncorporated; Vds - Drain-Source Breakdown Voltage: 75V; Vgs - Gate-Source Voltage: 20V; Rds On - Drain-Source Resistance: 1.4Ohms; Transistor Type: 1N-Channel; Configuration: Single; Unit Weight: 0.000212oz; Pd - Power Dissipation: 200mW; Id - Continuous Drain Current: 200mA; Forward Transconductance - Min: 0.1S; Manufacturer URL: http://www.diodes.com/; Series: BSS138; Package Description: 3-Pin Small Outline Transistor, Body 2 x 1.25 mm, Pitch 0.65 mm; Mounting Technology: SurfaceMount; Product Category: MOSFET; RoHS: True; Maximum Operating Temperature: +150C; Height: 1mm; Length: 2.2mm; Technology: Si; Width: 1.35mm; Datasheet URL: http://www.diodes.com/_files/datasheets/ds30206.pdf; Manufacturer: DiodesIncorporated; Package / Case: SOT-323-3; Typical Turn-On Delay Time: 20ns; Transistor Polarity: N-Channel; Factory Pack Quantity: 3000; Packaging: Reel; Product: MOSFETSmallSignal; Datasheet Version: Rev. 11-2, 09/2013; Package Reference: SOT323; Minimum Operating Temperature: -55C; Mounting Style: SMD/SMT; Channel Mode: Enhancement
Q11 Q13 = CMP-013-00036-1: Trans MOSFET P-CH 20V 22.1A 8-Pin PowerPAK 1212 EP T/R
R14 R35 R41 R43 R52 R61 = CMP-2000-00180-1: Manufacturer: Panasonic; Part Number: ERJ-3EKF1001V
R36 = CMP-1012-00849-3: RES SMD 1M OHM 1% 1/10W 0603; Resistance: 1MR; Voltage Rating: 75V; Temperature Coefficient: 100ppm/°C; Power Rating: 100mW; REACH SVHC: No SVHC; Radiation Hardening: No; Features: Automotive AEC-Q200; Case Code (Metric): 1608; Resistance Tolerance: 1%; Case/Package: 0603; Termination: SMD/SMT; Max Operating Temperature: 155°C; Tolerance: 1%; Size Code: 0603; Case Code (Imperial): 0603; Min Operating Temperature: -55°C; Number of Pins: 2; Mount: Surface Mount; Package Quantity: 1; Military Standard: Not; Voltage Rating (DC): 75V; Depth: 0.8mm; Packaging: Tape and Reel; Width: 0.8mm; Number of Terminations: 2; Length: 1.6mm; Height: 0.022inch; RoHS Compliant: Yes; Resistor Type: Thick Film; Contact Plating: Tin; Lead Free: Lead Free; Series: ERJ; Construction: Rectangular; Max Power Dissipation: 100mW
R37 = CMP-2000-00296-1: Manufacturer: Panasonic; Part Number: ERJ3EKF1803V
R38 R44 R45 R47-R49 R51 R56 R57 R59 = CMP-1012-00623-3: Chip Resistor, 10 KOhm, +/- 1%, 0.1 W, -55 to 155 degC, 0603 (1608 Metric), RoHS, Tape and Reel; Manufacturer: Panasonic; Voltage Rating: 75V; Case\/Package: 0603; Power Rating: 100mW; Resistance: 10KOhm; Temperature Coefficient: 100ppm\/degreesC; Number of Pins: 2; Package Reference: 603; Depth: 0.8mm; Mount: SurfaceMount; Package Description: 2-Pin Surface Mount Device, Body 1.6 x 0.85 mm; Datasheet Version: 02/2017; Length: 1.6mm; Lead Free: LeadFree; Height: 0.45mm; Number of Terminations: 2; Max Power Dissipation: 100mW; Min Operating Temperature: -55degC; Datasheet URL: https://industrial.panasonic.com/cdbs/www-data/pdf/RDA0000/AOA0000C304.pdf; Termination: SMD/SMT; Case Code (Metric): 1608; Case Code (Imperial): 0603; Tolerance: 1%; Max Operating Temperature: 155degC; RoHSCompliant: true; Voltage Rating (DC): 75V; Radiation Hardening: No; Packaging: TapeandReel; Composition: ThickFilm; Mounting Technology: SurfaceMount; Manufacturer URL: http://www.panasonic.com/; Width: 0.031inch; REACH SVHC: NoSVHC; Contact Plating: Tin; Military Standard: Not; Package Quantity: 1
R39 R60 = CMP-2000-00475-1: Manufacturer: Panasonic; Part Number: ERJ3EKF3901V
U10 = CMP-04918-000102-1: IC REG BCK BST 3.3V 3.5A 14VSON; Manufacturer: Texas Instruments; Max Junction Temp: +125°C; Output Current: 2A; Switching Topology: Buck-Boost; Min Supply Voltage: 1.8V; Standoff Height: 0mm; Switching Frequency: 2400kHz; Output Type: AdjustableProgrammable; Max Supply Voltage: 5.5V; Output Voltage: 1.2-5.5V; Max Duty Cycle: 100%; Number Of Outputs: 1; Nominal Supply Current: 25uA; Mouser Description: Conv DC-DC 1.8V to 5.5V Non-Inv/Inv/Step Up/Step Down Single-Out 3.3V 3A 14-Pin VSON EP T/R; Octopart: https://octopart.com/tps63021dsjr-texas+instruments-17659431; Temperature: -40°C to +85°C; RoHS: TRUE; Package: DSJ0014A; Device Class L3: Voltage Regulators - Switching; Height: 1mm; Ambient Temperature Range Low: -40°C; Device Class L2: Power Management ICs; Temperature Range High: +85°C; ComponentLink2URL: http://www.ti.com/lit/ds/symlink/tps63021.pdf; Device Class L1: Integrated Circuits (ICs); ComponentLink2Description: Datasheet; Automotive: No; Manufacturer Part Number: TPS63021DSJR; Lead Free: Yes; Digikey Description: IC REG BCK BST 3.3V 3.5A 14VSON; Temperature Range Low: -40°C; Category: IC; Ambient Temperature Range High: +85°C
U11 = CMP-0321-00456-2: 800 mA, Single-Input, Single Cell Li-Ion Battery Charger with Auto Start. Vovp=6.6 V, 3.5 V, -40 to 85 degC, 10-pin SON (DSQ), Green (RoHS & no Sb/Br); Manufacturer: Texas Instruments; NiCd: N; Vin(Min)(V): 3.5; SubFamily: Battery Charge Management; PackageDescription: 10-Pin Plastic Small Outline No-Lead, 2 x 2 x 0.8 mm Body, 0.4 mm Pitch, Exposed Pad; PackageVersion: revB, Apr-2010; Mounting Technology: Surface Mount; Eco-Plan: Green (RoHS & no Sb/Br); ComponentLink1URL: http://www.ti.com/general/docs/lit/getliterature.tsp?genericPartNumber=BQ24040&fileType=pdf; PartNumber: BQ24040DSQR; DatasheetVersion: SLUS941A; Over Voltage Protection: N; PackageReference: DSQ0010A; NiMH: N; Li-Ion: N; Lead Acid: N; Li-Polymer: N; ComponentLink1Description: Datasheet
U13 = CMP-04896-000098-1: 40V, RAIL-TO-RAIL INPUT, PUSH-PU

## Nets that join several sheets
3V3: OC_PROT (Q4.5-6-7-8), STM32L0_PINOUT (13 pins), CAN_FD_INTERFACE (C4.2 C5.2 U2.14 U5.3), GPS (C10.1 Q5.2 R2.2 U7.6), SX1278_RADIO (9 pins), PWR_MGMT (6 pins)
5V: HYDRA_V3_BEACON (U14.2), OC_PROT (F1.2), STM32L0_PINOUT (D1.2 R18.2), PWR_MGMT (5 pins)
BUZZ+: HYDRA_V3_BEACON (5 pins), OC_PROT (U4.6), STM32L0_PINOUT (D12.C R9.2 R20.2)
GND: HYDRA_V3_BEACON (45 pins), OC_PROT (C16.2 R12.1 R13.1 U4.2), STM32L0_PINOUT (20 pins), CAN_FD_INTERFACE (9 pins), GPS (13 pins), SX1278_RADIO (30 pins), PWR_MGMT (25 pins)
V_BATT: HYDRA_V3_BEACON (F2.2), PWR_MGMT (6 pins)
3V3_OC_TP: OC_PROT (D5.A R17.1 U4.1), PWR_MGMT (R38.2)
3V3_PRE_SHUNT: HYDRA_V3_BEACON (8 pins), OC_PROT (R15.1 R16.2)
BATT_DISABLE: STM32L0_PINOUT (U1.21), PWR_MGMT (D11.A)
BATT_ENABLE: STM32L0_PINOUT (U1.22), PWR_MGMT (D10.A R38.1 R39.2)
BATT_SENSE: STM32L0_PINOUT (U1.13), PWR_MGMT (R45.1 R49.2)
BATT_TS: HYDRA_V3_BEACON (P2.3), PWR_MGMT (U11.9)
BUZZ-: HYDRA_V3_BEACON (P1.2), STM32L0_PINOUT (D12.A Q14.3 R9.1)
CAN0_N: HYDRA_V3_BEACON (J1.16 J3.16), CAN_FD_INTERFACE (R1.1 U5.6)
CAN0_P: HYDRA_V3_BEACON (J1.15 J3.15), CAN_FD_INTERFACE (R1.2 U5.7)
CAN_CS: STM32L0_PINOUT (U1.25), CAN_FD_INTERFACE (U2.13)
CAN_SCK: STM32L0_PINOUT (U1.26), CAN_FD_INTERFACE (U2.10), SX1278_RADIO (U8.16)
CAN_SDI: STM32L0_PINOUT (U1.28), CAN_FD_INTERFACE (U2.11), SX1278_RADIO (U8.18)
CAN_SDO: STM32L0_PINOUT (U1.27), CAN_FD_INTERFACE (U2.12), SX1278_RADIO (U8.17)
DISABLE_HYDRA_POWER: OC_PROT (D6.A), PWR_MGMT (R52.1)
GPS_ENABLE: STM32L0_PINOUT (U1.14), GPS (R7.1)
GPS_RESET: STM32L0_PINOUT (U1.15), GPS (U6.18)
GPS_STAT_LED: HYDRA_V3_BEACON (R40.1), STM32L0_PINOUT (U1.30), GPS (U6.11)
HYDRA_3V3_SENSE: OC_PROT (R11.1 R12.2), STM32L0_PINOUT (U1.11)
INT_3V3_SENSE: STM32L0_PINOUT (U1.10), PWR_MGMT (R44.1 R48.2)
LORA_CS: STM32L0_PINOUT (U1.18), SX1278_RADIO (U8.19)
PRE_5V: HYDRA_V3_BEACON (8 pins), OC_PROT (F1.1)
PYRO_PWR: HYDRA_V3_BEACON (16 pins), STM32L0_PINOUT (R21.2)
RXD: STM32L0_PINOUT (U1.29), GPS (U6.12)
RXTX/RF_MOD: HYDRA_V3_BEACON (R33.2), SX1278_RADIO (C27.1 R34.2 U8.20)